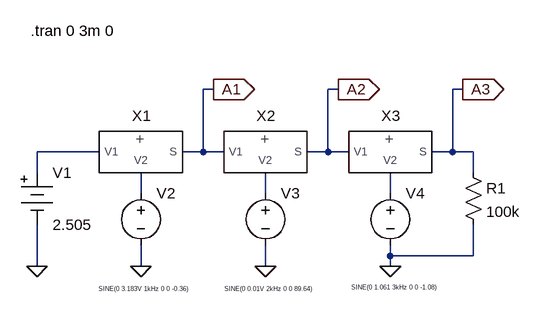
[diagram p0: schematic E5-1-Arm1-2-3.asc]
E5-1-Arm1-2-3.asc, the LTspice schematic file:
Version 4
SHEET 1 944 680
WIRE 304 80 288 80
WIRE 496 80 480 80
WIRE 688 80 672 80
WIRE 128 176 32 176
WIRE 288 176 288 80
WIRE 288 176 256 176
WIRE 320 176 288 176
WIRE 480 176 480 80
WIRE 480 176 448 176
WIRE 512 176 480 176
WIRE 672 176 672 80
WIRE 672 176 640 176
WIRE 704 176 672 176
WIRE 32 208 32 176
WIRE 704 208 704 176
WIRE 192 240 192 208
WIRE 384 240 384 208
WIRE 576 240 576 208
WIRE 576 336 576 320
WIRE 704 336 704 288
WIRE 704 336 576 336
WIRE 32 352 32 288
WIRE 192 352 192 320
WIRE 384 352 384 320
WIRE 576 352 576 336
FLAG 32 352 0
FLAG 192 352 0
FLAG 384 352 0
FLAG 576 352 0
FLAG 304 80 A1
IOPIN 304 80 Out
FLAG 496 80 A2
IOPIN 496 80 Out
FLAG 688 80 A3
IOPIN 688 80 Out
SYMBOL voltage 192 224 R0
WINDOW 3 -65 163 Left 0
WINDOW 123 0 0 Left 0
WINDOW 39 0 0 Left 0
SYMATTR Value SINE(0 3.183V 1kHz 0 0 -0.36)
SYMATTR InstName V2
SYMBOL Misc\\battery 32 192 R0
SYMATTR InstName V1
SYMATTR Value 2.505
SYMBOL Mis_Componentes\\E7-sumador-analogico 192 176 R0
SYMATTR InstName X1
SYMBOL Mis_Componentes\\E7-sumador-analogico 384 176 R0
SYMATTR InstName X2
SYMBOL Mis_Componentes\\E7-sumador-analogico 576 176 R0
SYMATTR InstName X3
SYMBOL voltage 384 224 R0
WINDOW 3 -63 163 Left 0
WINDOW 123 0 0 Left 0
WINDOW 39 0 0 Left 0
SYMATTR Value SINE(0 0.01V 2kHz 0 0 89.64)
SYMATTR InstName V3
SYMBOL voltage 576 224 R0
WINDOW 3 -60 160 Left 0
WINDOW 123 0 0 Left 0
WINDOW 39 0 0 Left 0
SYMATTR Value SINE(0 1.061 3kHz 0 0 -1.08)
SYMATTR InstName V4
SYMBOL res 688 192 R0
SYMATTR InstName R1
SYMATTR Value 100k
TEXT 22 -10 Left 2 !.tran 0 3m 0

The netlist it stands for:
* E5-1-Arm1-2-3.asc
V2 N002 0 SINE(0 3.183V 1kHz 0 0 -0.36)
V1 N001 0 2.505
XX1 N001 N002 A1 E7-sumador-analogico  ; pins V1 V2 S
XX2 A1 N003 A2 E7-sumador-analogico  ; pins V1 V2 S
XX3 A2 N004 A3 E7-sumador-analogico  ; pins V1 V2 S
V3 N003 0 SINE(0 0.01V 2kHz 0 0 89.64)
V4 N004 0 SINE(0 1.061 3kHz 0 0 -1.08)
R1 A3 0 100k
.tran 0 3m 0
.backanno
.end